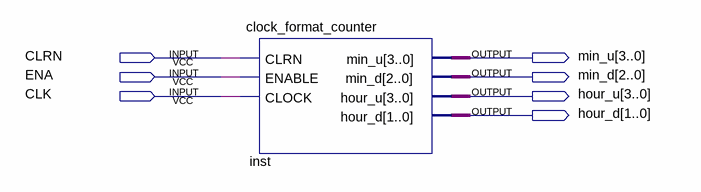
[diagram p0: schematic sheet]
// Quartus schematic clock_format_counter_tb.bdf as structural Verilog: 1 symbols, 7 pins
module clock_format_counter_tb (
  input  CLRN,
  input  ENA,
  input  CLK,
  output [3:0] min_u,
  output [2:0] min_d,
  output [3:0] hour_u,
  output [1:0] hour_d
);

  clock_format_counter inst (
    .CLRN(CLRN), .ENABLE(ENA), .CLOCK(CLK), .min_u(min_u), .min_d(min_d), .hour_u(hour_u), .hour_d(hour_d));
endmodule
